# EAGLE schematic SHTC3 Breakout-BottomJig (EAGLE 9.1.3)
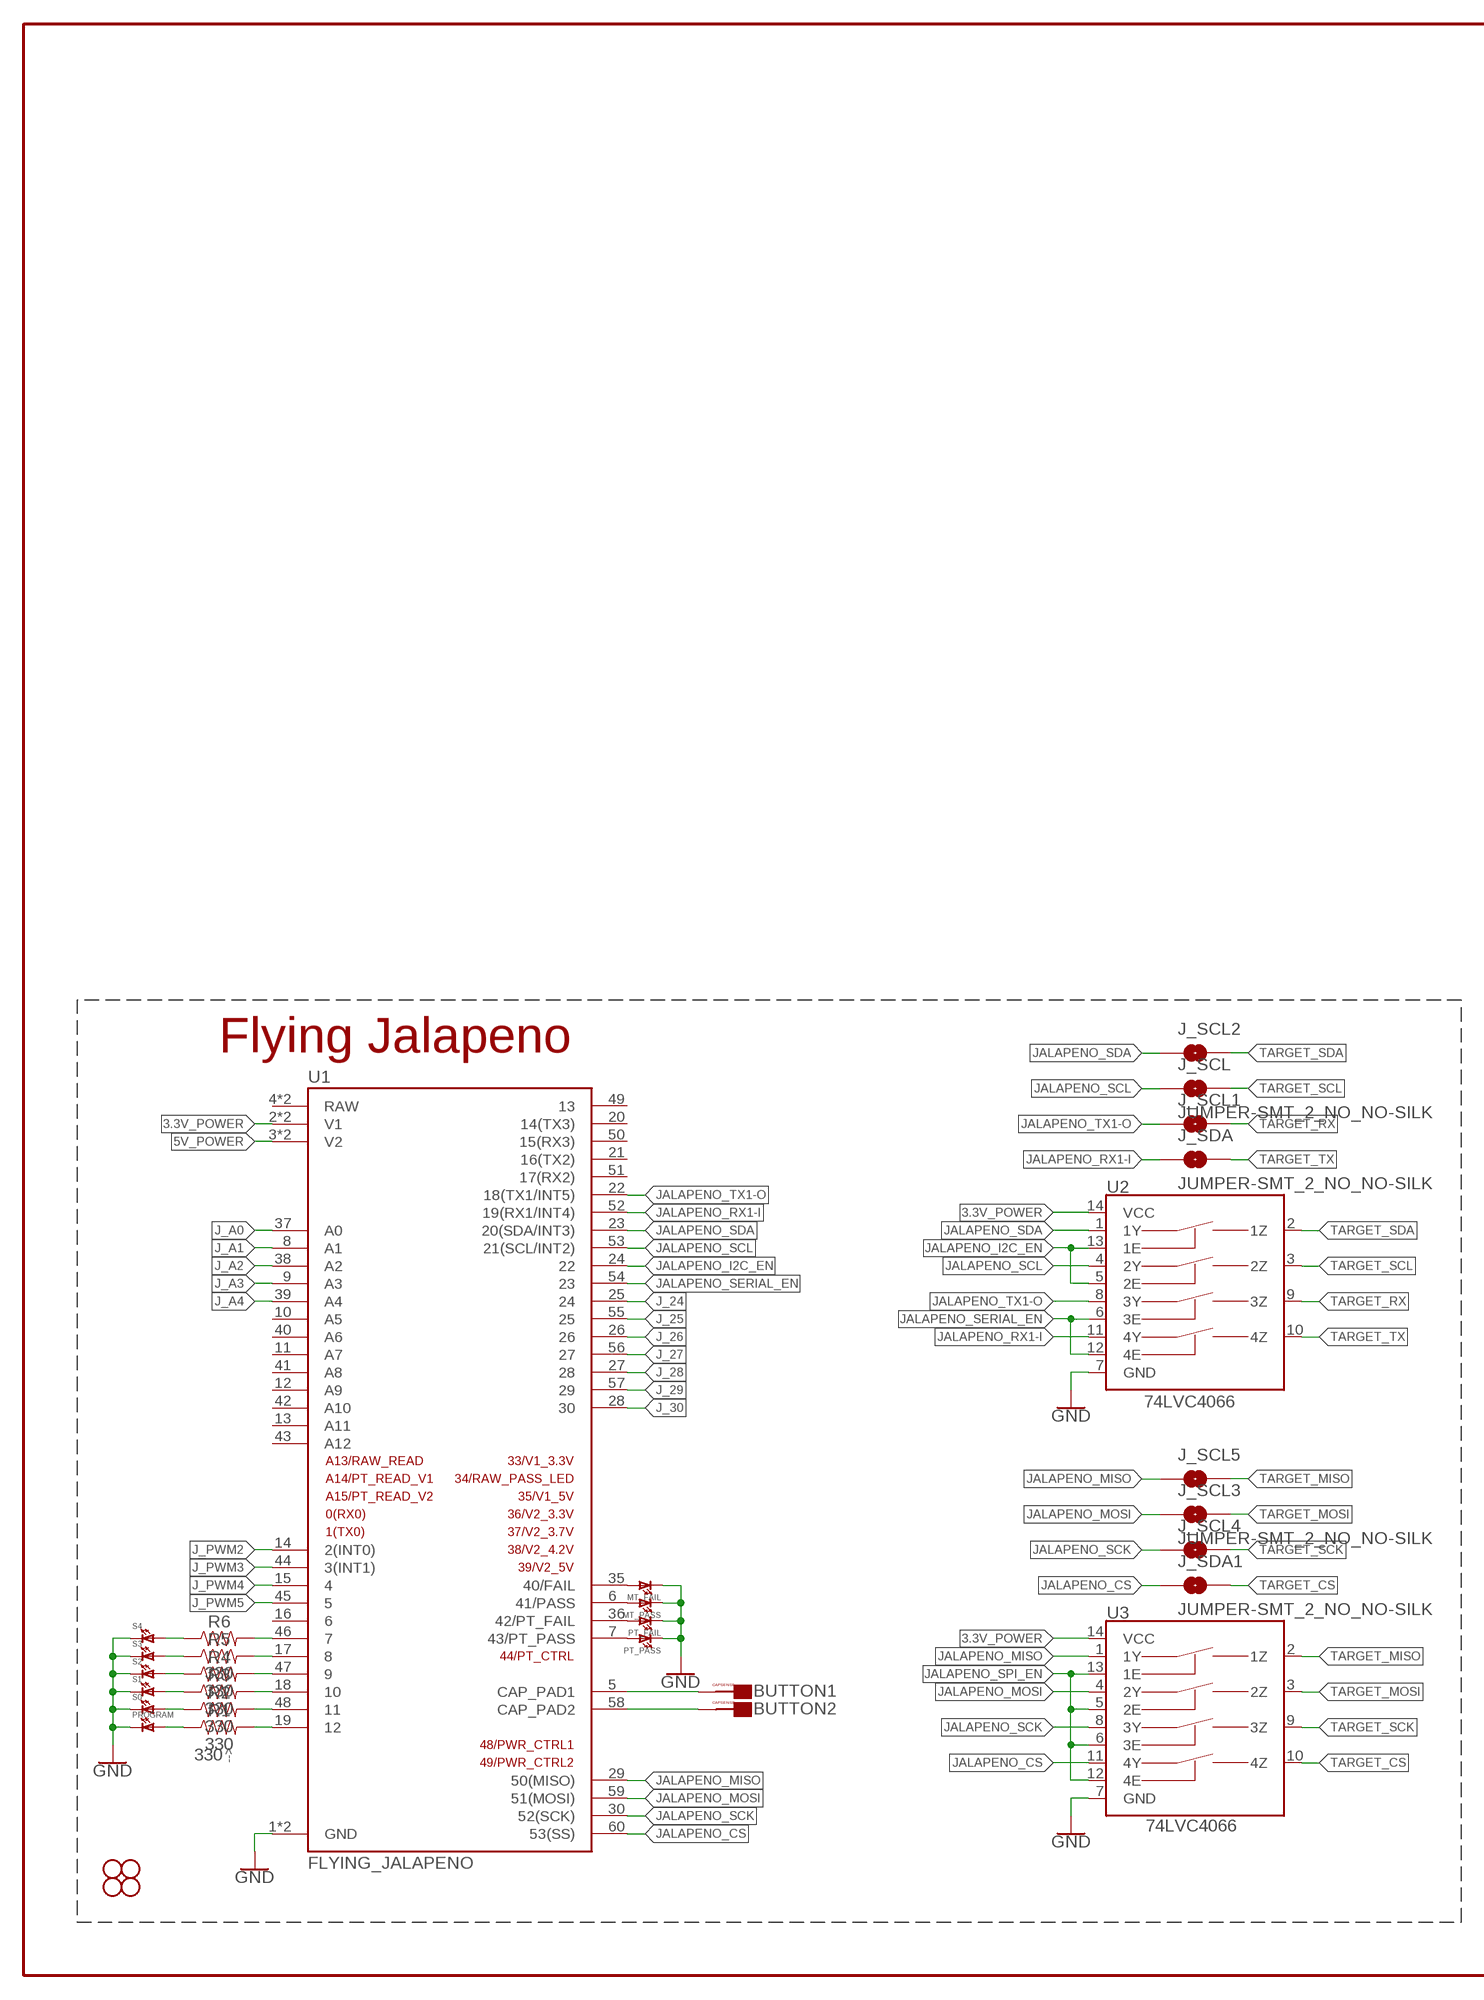
[diagram p0: schematic, sheet 1, part 1 of 2]
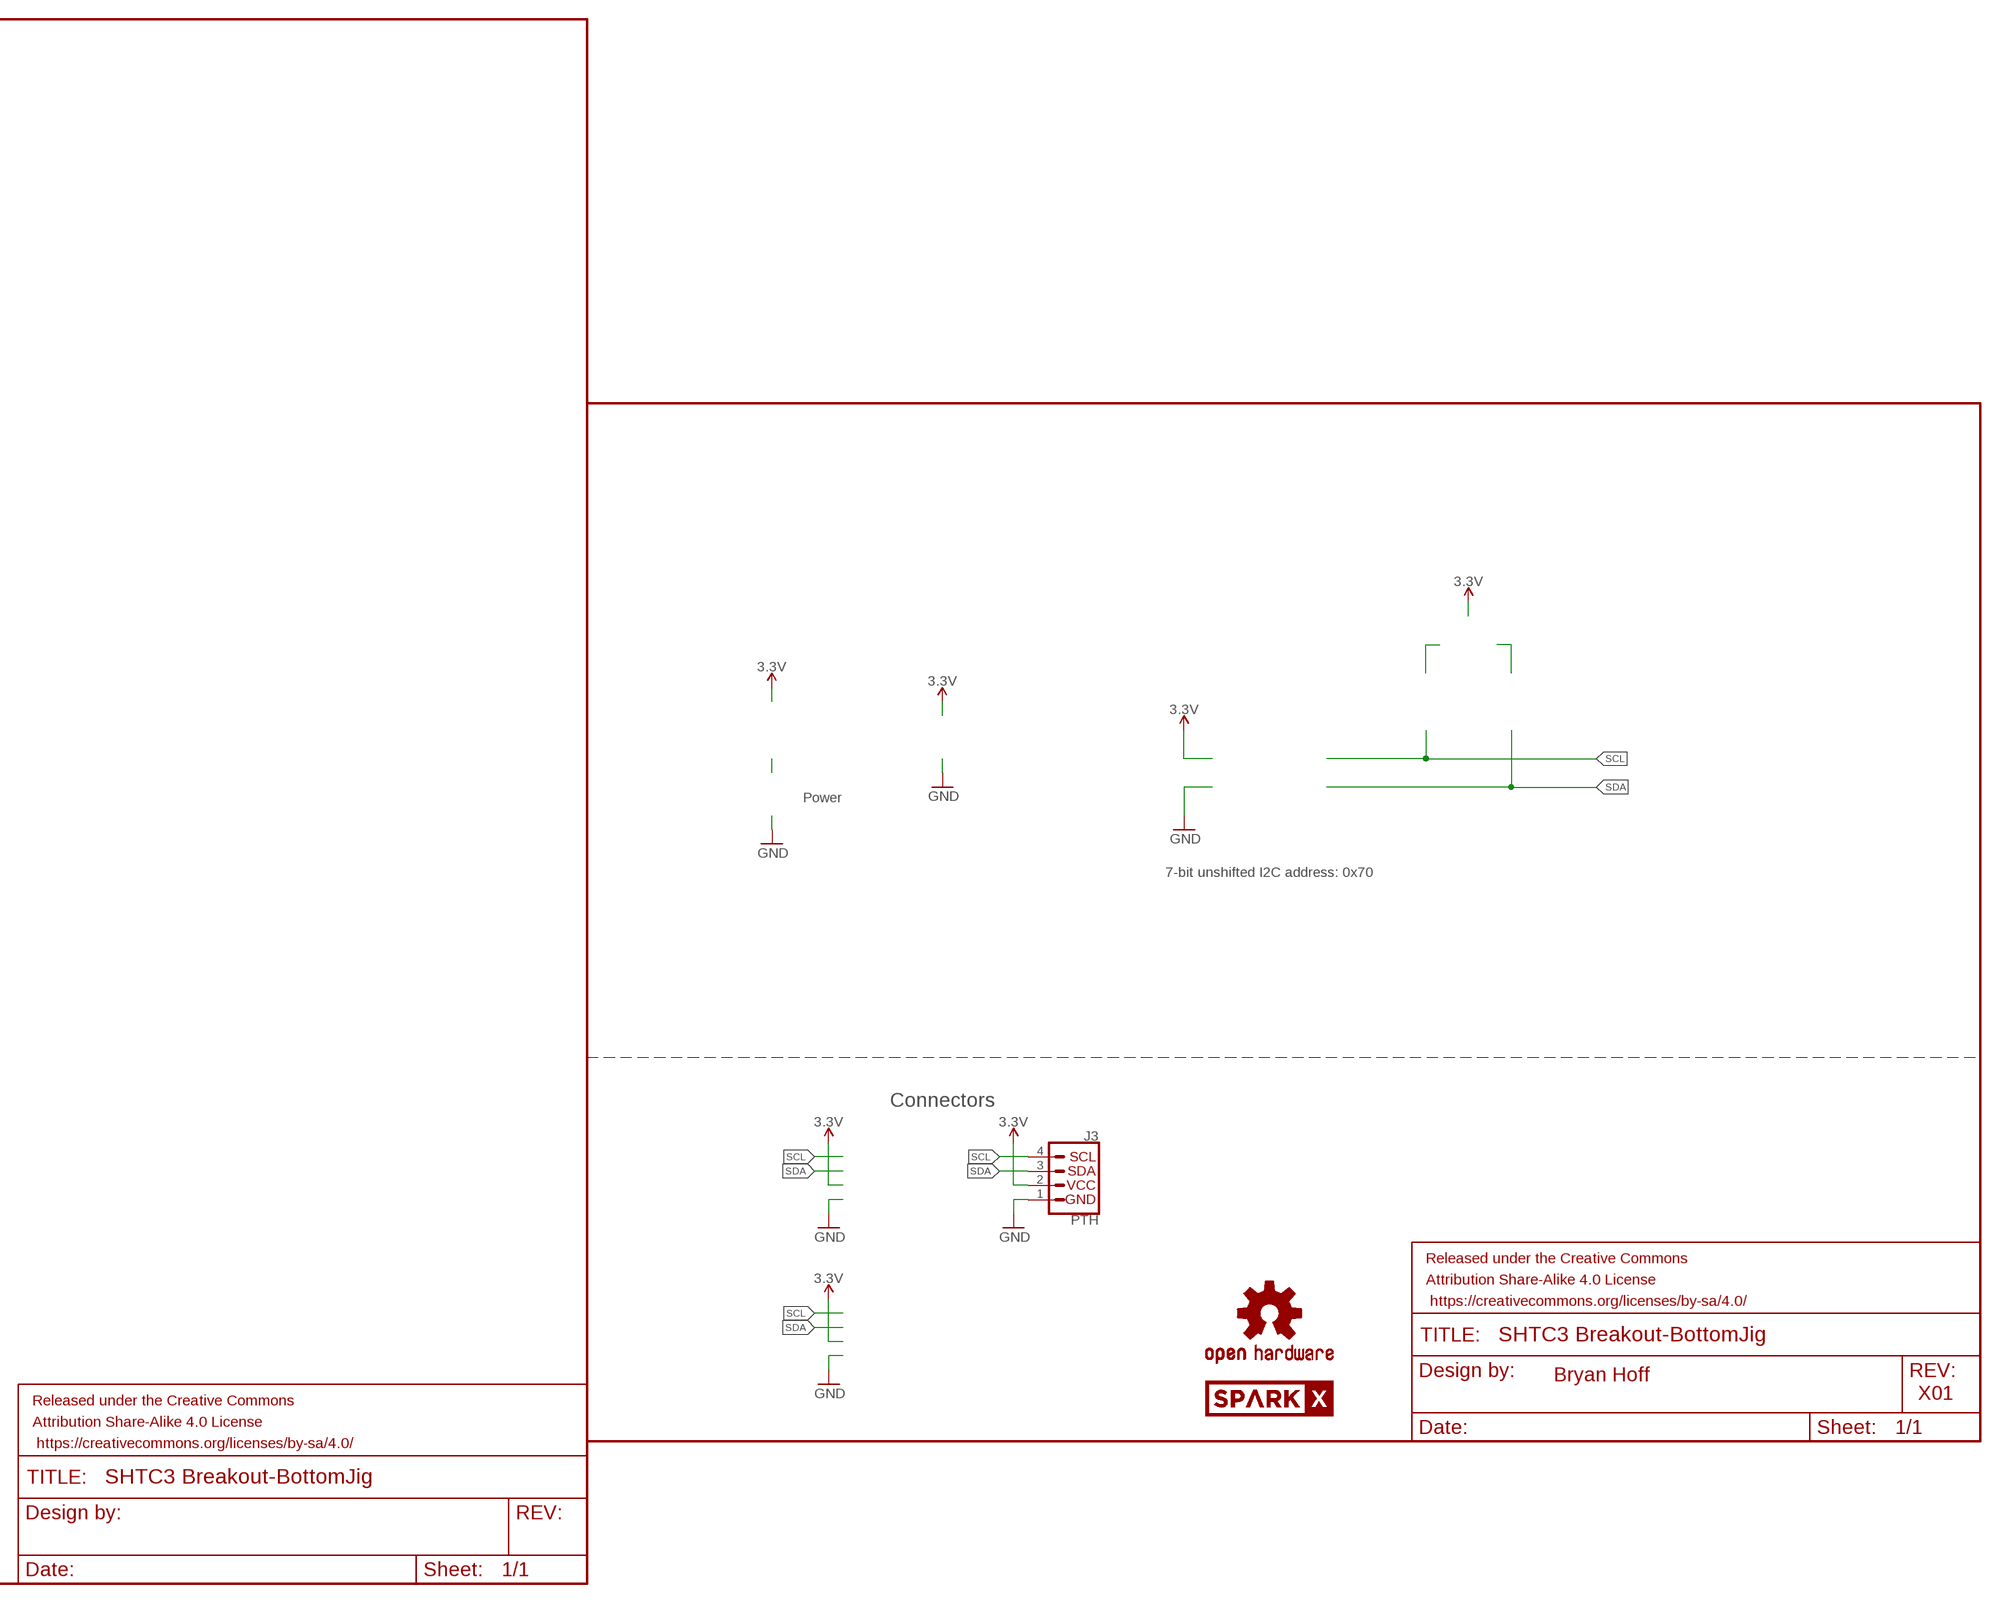
[diagram p1: schematic, sheet 1, part 2 of 2]

## Parts
BUTTON1  CAPSENSE_BUTTON_PAD_ONLY  [CAPSENSE_BUTTON_PADS_ONLY]
BUTTON2  CAPSENSE_BUTTON_PAD_ONLY  [CAPSENSE_BUTTON_PADS_ONLY]
FRAME1  FRAME-LETTER  [CREATIVE_COMMONS]
FRAME2  FRAME-LEDGER  [CREATIVE_COMMONS]
H1  STAND-OFF  [STAND-OFF]
H2  STAND-OFF  [STAND-OFF]
H3  STAND-OFF  [STAND-OFF]
H4  STAND-OFF  [STAND-OFF]
J3  PTH  I2C_STANDARD_NO_SILK  [1X04_NO_SILK]
J_SCL  JUMPER-SMT_2_NO_NO-SILK  [SMT-JUMPER_2_NO_NO-SILK]
J_SCL1  JUMPER-SMT_2_NO_NO-SILK  [SMT-JUMPER_2_NO_NO-SILK]
J_SCL2  JUMPER-SMT_2_NO_NO-SILK  [SMT-JUMPER_2_NO_NO-SILK]
J_SCL3  JUMPER-SMT_2_NO_NO-SILK  [SMT-JUMPER_2_NO_NO-SILK]
J_SCL4  JUMPER-SMT_2_NO_NO-SILK  [SMT-JUMPER_2_NO_NO-SILK]
J_SCL5  JUMPER-SMT_2_NO_NO-SILK  [SMT-JUMPER_2_NO_NO-SILK]
J_SDA  JUMPER-SMT_2_NO_NO-SILK  [SMT-JUMPER_2_NO_NO-SILK]
J_SDA1  JUMPER-SMT_2_NO_NO-SILK  [SMT-JUMPER_2_NO_NO-SILK]
LOGO1  OSHW-LOGOMINI  [OSHW-LOGO-MINI]
MT_FAIL  LED1206  [LED-1206]
MT_PASS  LED1206  [LED-1206]
PROGRAM  LED1206  [LED-1206]
PT_FAIL  LED1206  [LED-1206]
PT_PASS  LED1206  [LED-1206]
R1  330  330OHM-0603-1/10W-1%  [0603]
R2  330  330OHM-0603-1/10W-1%  [0603]
R3  330  330OHM-0603-1/10W-1%  [0603]
R4  330  330OHM-0603-1/10W-1%  [0603]
R5  330  330OHM-0603-1/10W-1%  [0603]
R6  330  330OHM-0603-1/10W-1%  [0603]
S0  LED1206  [LED-1206]
S1  LED1206  [LED-1206]
S2  LED1206  [LED-1206]
S3  LED1206  [LED-1206]
S4  LED1206  [LED-1206]
U1  FLYING_JALAPENO  FLYING_JALAPENO_V3MALE  [FLYING_JALAPENO_V3_M]
U2  74LVC4066  74LVC4066_MUX_1:1_X4  [SO14]
U3  74LVC4066  74LVC4066_MUX_1:1_X4  [SO14]
U$1  SPARKX-LOGO4  [SPARKX-MEDIUM]
U$2  SPARKX-LOGO4  [SPARKX-MEDIUM]

## Nets
3.3V: J3.2(VCC)
3.3V_POWER [VCC]: U1.2(V1) U1.32(V1) U2.14(VCC) U3.14(VCC)
5V_POWER [POWA]: U1.3(V2) U1.33(V2)
GND: J3.1(GND) MT_FAIL.C MT_PASS.C PROGRAM.C PT_FAIL.C PT_PASS.C S0.C S1.C S2.C S3.C S4.C U1.1(GND) U1.31(GND) U2.7(GND) U3.7(GND)
J_24: U1.25
J_25: U1.55
J_26: U1.26
J_27: U1.56
J_28: U1.27
J_29: U1.57
J_30: U1.28
J_A0: U1.37(A0)
J_A1: U1.8(A1)
J_A2: U1.38(A2)
J_A3: U1.9(A3)
J_A4: U1.39(A4)
J_PWM2: U1.14(2(INT0))
J_PWM3: U1.44(3(INT1))
J_PWM4: U1.15
J_PWM5: U1.45
JALAPENO_CS: J_SDA1.1 U1.60(53(SS)) U3.11(4Y)
JALAPENO_I2C_EN: U1.24 U2.5(2E) U2.13(1E)
JALAPENO_MISO: J_SCL5.1 U1.29(50(MISO)) U3.1(1Y)
JALAPENO_MOSI: J_SCL3.1 U1.59(51(MOSI)) U3.4(2Y)
JALAPENO_RX1-I: J_SDA.1 U1.52(19(RX1/INT4)) U2.11(4Y)
JALAPENO_SCK: J_SCL4.1 U1.30(52(SCK)) U3.8(3Y)
JALAPENO_SCL: J_SCL.1 U1.53(21(SCL/INT2)) U2.4(2Y)
JALAPENO_SDA: J_SCL2.1 U1.23(20(SDA/INT3)) U2.1(1Y)
JALAPENO_SERIAL_EN: U1.54 U2.6(3E) U2.12(4E)
JALAPENO_SPI_EN: U3.5(2E) U3.6(3E) U3.12(4E) U3.13(1E)
JALAPENO_TX1-O: J_SCL1.1 U1.22(18(TX1/INT5)) U2.8(3Y)
N$4: PT_PASS.A U1.7(43/PT_PASS)
N$5: PT_FAIL.A U1.36(42/PT_FAIL)
N$6: MT_PASS.A U1.6(41/PASS)
N$7: MT_FAIL.A U1.35(40/FAIL)
N$8: BUTTON2.CAPSENSE_PAD(CAPSENSE) U1.58(CAP_PAD2)
N$9: BUTTON1.CAPSENSE_PAD(CAPSENSE) U1.5(CAP_PAD1)
N$10: R6.2 U1.46
N$11: R1.2 U1.19
N$12: PROGRAM.A R1.1
N$13: R5.2 U1.17
N$14: R4.2 U1.47
N$15: R3.2 U1.18
N$16: R2.2 U1.48
N$17: R6.1 S4.A
N$18: R5.1 S3.A
N$19: R4.1 S2.A
N$20: R3.1 S1.A
N$21: R2.1 S0.A
SCL: J3.4(SCL)
SDA: J3.3(SDA)
TARGET_CS: J_SDA1.2 U3.10(4Z)
TARGET_MISO: J_SCL5.2 U3.2(1Z)
TARGET_MOSI: J_SCL3.2 U3.3(2Z)
TARGET_RX: J_SCL1.2 U2.9(3Z)
TARGET_SCK: J_SCL4.2 U3.9(3Z)
TARGET_SCL: J_SCL.2 U2.3(2Z)
TARGET_SDA: J_SCL2.2 U2.2(1Z)
TARGET_TX: J_SDA.2 U2.10(4Z)
Unconnected: U1.4(RAW) U1.10(A5) U1.11(A7) U1.12(A9) U1.13(A11) U1.16 U1.20(14(TX3)) U1.21(16(TX2)) U1.34(RAW) U1.40(A6) U1.41(A8) U1.42(A10) U1.43(A12) U1.49 U1.50(15(RX3)) U1.51(17(RX2))

## Notes on the sheet
- Power
- Flying Jalapeno
- 7-bit unshifted I2C address: 0x70
- Connectors
- Bryan Hoff
- X01
- -->

## Library data of the parts
BUTTON1 BUTTON2 = Testing:CAPSENSE_BUTTON_PAD_ONLY
FRAME1 = SparkFun-Aesthetics:FRAME-LETTER: Schematic Frame - Letter Standard 8.5x11 US Letter frame
FRAME2 = SparkFun-Aesthetics:FRAME-LEDGER: Schematic Frame - Ledger Standard 11x14 US Ledger frame
H1-H4 = SparkFun-Hardware:STAND-OFF: Stand Off Drill holes for mechanically mounting via screws, standoffs, etc. Note: Use the keepout ring to avoid running the screw head into surrounding components. Variant Overviews STAND-OFF - Mechanical footprint for a #4 phillips button head screw. STAND-OFF-TIGHT - Mechanical footprint for a #4 phillips button head screw, Example SparkFun Products Screw - Phillips Head (1/4", 4-40, 10 pack) <https://www.sparkfun.com/products/10453> (PRT-10453) Screw - Phillips Head (1/2", 4-40, 10 pack) <https://www.sparkfun.com/products/10452> (PRT-10452) Screw - Phillips Head (3/4", 4-40, 10 pack) <https://www.sparkfun.com/products/10451> (PRT-10451) Screw - Phillips Head (1", 4-40, 10 pack) <https://www.sparkfun.com/products/10450> (PRT-10450)
J3 = SparkX:I2C_STANDARD: SparkFun I2C Standard Pinout Header SparkFun has standardized on a pinout for all I2C based sensor breakouts. This pinout allows I2C boards to be plugged directly into the headers on Arduino Uno compatible boards, and to be daisy chained easily. Example SparkFun Products: SparkFun Atmospheric Sensor Breakout - BME280 <https://www.sparkfun.com/products/13676> SparkFun Altitude/Pressure Sensor Breakout - MPL3115A2 <https://www.sparkfun.com/products/11084> SparkFun TOF Range Finder Sensor - VL6180 <https://www.sparkfun.com/products/12785>
J_SCL J_SCL1-J_SCL5 J_SDA J_SDA1 = SparkFun-Jumpers:JUMPER-SMT_2_NO: Normally open jumper This jumper has two pads in close proximity to each other. Apply solder to close the connection. Round pads are easier to solder for beginners, but are a lot larger. SparkFun Product that uses the round pads: SparkFun EL Sequencer <https://www.sparkfun.com/products/12781>
LOGO1 = SparkFun-Aesthetics:OSHW-LOGO: Open-Source Hardware (OSHW) Logo This logo indicates the piece of hardware it is found on incorporates a OSHW license and/or adheres to the definition of open source hardware found here: http://freedomdefined.org/OSHW
MT_FAIL MT_PASS PROGRAM PT_FAIL PT_PASS S0 S1-S4 = Testing:LED: LEDs Standard schematic elements and footprints for 5mm, 3mm, 1206, and 0603 sized LEDs. 5mm - Spark Fun Electronics SKU : COM-00529 (and others)
R1-R6 = SparkFun-Resistors:330OHM: 330Ω resistor A resistor is a passive two-terminal electrical component that implements electrical resistance as a circuit element. Resistors act to reduce current flow, and, at the same time, act to lower voltage levels within circuits. - Wikipedia; PROD_ID: RES-00818
U1 = Testing:FLYING_JALAPENO_V3
U2 U3 = Testing:74LVC4066_MUX_1:1_X4
U$1 U$2 = SparkX:SPARKX-LOGO

## Net classes
1 VCC: width 0.381 mm
2 POWA: width 0.61 mm